# Altium schematic sheet ETHNET.SchDoc
size 203 x 152 mm
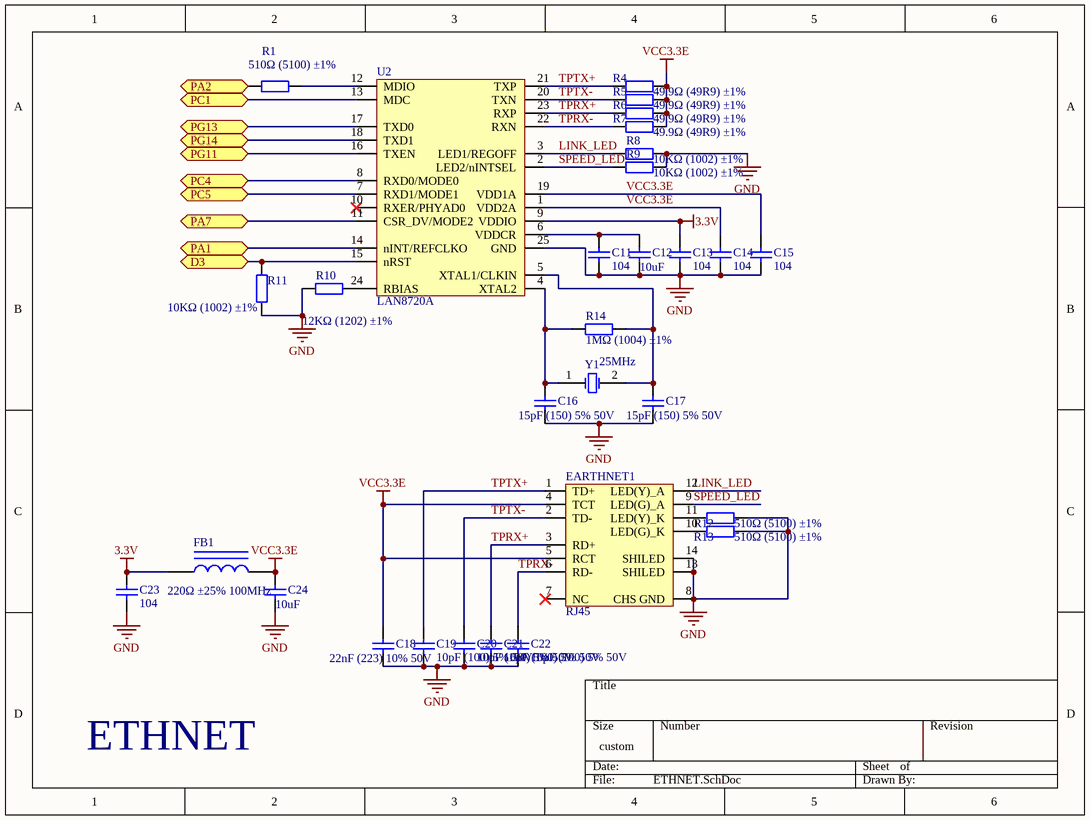
[diagram p0: ETHNET.SchDoc]

## Parts
C11  104  [0805_C]
C12  10uF  [0805_C]
C13  104  [0805_C]
C14  104  [0805_C]
C15  104  [0805_C]
C16  15pF (150) 5% 50V  [0805_C]
C17  15pF (150) 5% 50V  [0805_C]
C18  22nF (223) 10% 50V  [0805_C]
C19  10pF (100) 5% 50V  [0805_C]
C20  10pF (100) 5% 50V  [0805_C]
C21  10pF (100) 5% 50V  [0805_C]
C22  10pF (100) 5% 50V  [0805_C]
C23  104  [0805_C]
C24  10uF  [0805_C]
EARTHNET1  RJ45  [HR911105A]
FB1  220Ω ±25% 100MHz  [0805_L]
R1  510Ω (5100) ±1%  [0805_R]
R4  49.9Ω (49R9) ±1%  [0805_R]
R5  49.9Ω (49R9) ±1%  [0805_R]
R6  49.9Ω (49R9) ±1%  [0805_R]
R7  49.9Ω (49R9) ±1%  [0805_R]
R8  10KΩ (1002) ±1%  [0805_R]
R9  10KΩ (1002) ±1%  [0805_R]
R10  12KΩ (1202) ±1%  [0805_R]
R11  10KΩ (1002) ±1%  [0805_R]
R12  510Ω (5100) ±1%  [0805_R]
R13  510Ω (5100) ±1%  [0805_R]
R14  1MΩ (1004) ±1%  [0805_R]
U2  LAN8720A  [QFN24]
Y1  25MHz  [XTAL_US]

## Ports
D3, PA1, PA2, PA7, PC1, PC4, PC5, PG11, PG13, PG14

## Nets
3.3V: C13.2 C23.2 FB1.1 U2.9(VDDIO)
GND: C11.1 C12.1 C13.1 C14.1 C15.1 C16.1 C17.1 C18.1 C19.1 C20.1 C21.1 C22.1 C23.1 C24.1 EARTHNET1.8(CHS_GND) EARTHNET1.13(SHILED) EARTHNET1.14(SHILED) R8.2 R9.2 R10.1 R11.1 R12.1 R13.1 U2.25(GND)
VCC3.3E: C14.2 C15.2 C18.2 C24.2 EARTHNET1.4(TCT) EARTHNET1.5(RCT) FB1.2 R4.2 R5.2 R6.2 R7.2 U2.1(VDD2A) U2.19(VDD1A)
D3: R11.2 U2.15(nRST) ; port D3
LINK_LED: EARTHNET1.12(LED(Y)_A) R8.1 U2.3(LED1/REGOFF)
PA1: U2.14(nINT/REFCLKO) ; port PA1
PA2: R1.1 ; port PA2
PA7: U2.11(CSR_DV/MODE2) ; port PA7
PC1: U2.13(MDC) ; port PC1
PC4: U2.8(RXD0/MODE0) ; port PC4
PC5: U2.7(RXD1/MODE1) ; port PC5
PG11: U2.16(TXEN) ; port PG11
PG13: U2.17(TXD0) ; port PG13
PG14: U2.18(TXD1) ; port PG14
SPEED_LED: EARTHNET1.9(LED(G)_A) R9.1 U2.2(LED2/nINTSEL)
TPRX+: C21.2 EARTHNET1.3(RD+) R6.1 U2.23(RXP)
TPRX-: C22.2 EARTHNET1.6(RD-) R7.1 U2.22(RXN)
TPTX+: C19.2 EARTHNET1.1(TD+) R4.1 U2.21(TXP)
TPTX-: C20.2 EARTHNET1.2(TD-) R5.1 U2.20(TXN)
NetC11_2: C11.2 C12.2 U2.6(VDDCR)
NetC16_2: C16.2 R14.1 U2.4(XTAL2) Y1.1(OSC1)
NetC17_2: C17.2 R14.2 U2.5(XTAL1/CLKIN) Y1.2(OSC2)
NetEARTHNET1_10: EARTHNET1.10(LED(G)_K) R13.2
NetEARTHNET1_11: EARTHNET1.11(LED(Y)_K) R12.2
NetR1_2: R1.2 U2.12(MDIO)
NetR10_2: R10.2 U2.24(RBIAS)

Not connected (* = marked no-connect by the designer): EARTHNET1 7(NC)*; U2 10(RXER/PHYAD0)*

## Notes on the sheet
- ETHNET

## Library data of the parts
C11-C15 C23 C24 = 0805 100nF(104) 10% 50V: 贴片电容; ComponentLink1Description: 供应商链接; ComponentLink1URL: http://www.szlcsc.com/product/details_50686.html; Package: 0805; Supplier: LC; SuppliersPartNumber: C49678
C16 C17 = 0805 15pF (150) 5% 50V: 贴片电容; ComponentLink1Description: 供应商链接; ComponentLink1URL: http://www.szlcsc.com/product/details_2146.html; Package: 0805; Supplier: LC; SuppliersPartNumber: C1794
C18 = 0805 22nF (223) 10% 50V: 贴片电容; ComponentLink1Description: 供应商链接; ComponentLink1URL: http://www.szlcsc.com/product/details_2081.html; Package: 0805; Supplier: LC; SuppliersPartNumber: C1729
C19-C22 = 0805 10pF (100) 5% 50V: 贴片电容; ComponentLink1Description: 供应商链接; ComponentLink1URL: http://www.szlcsc.com/product/details_2137.html; Package: 0805; Supplier: LC; SuppliersPartNumber: C1785
EARTHNET1 = HR911105
FB1 = 0805 100Ω 25% 100MHz: 贴片磁珠; ComponentLink1Description: 供应商链接; ComponentLink1URL: http://www.szlcsc.com/product/details_1367.html; Package: 0805; Supplier: LC; SuppliersPartNumber: C1015
R1 R12 R13 = 0805 510Ω (5100) 1%: 贴片电阻; ComponentLink1Description: 供应商链接; ComponentLink1URL: http://www.szlcsc.com/product/details_18422.html; Package: 0805; Supplier: LC; SuppliersPartNumber: C17734
R4-R7 = 0805 49.9Ω (49R9) 1%: 贴片电阻; ComponentLink1Description: 供应商链接; ComponentLink1URL: http://www.szlcsc.com/product/details_18408.html; Package: 0805; Supplier: LC; SuppliersPartNumber: C17720
R8 R9 R11 = 0805 10KΩ (1002) 1%: 贴片电阻; ComponentLink1Description: 供应商链接; ComponentLink1URL: http://www.szlcsc.com/product/details_18102.html; Package: 0805; Supplier: LC; SuppliersPartNumber: C17414
R10 = 0805 12KΩ (1202) 1%: 贴片电阻; ComponentLink1Description: 供应商链接; ComponentLink1URL: http://www.szlcsc.com/product/details_18132.html; Package: 0805; Supplier: LC; SuppliersPartNumber: C17444
R14 = 0805 1MΩ (1004) 1%: 贴片电阻; ComponentLink1Description: 供应商链接; ComponentLink1URL: http://www.szlcsc.com/product/details_18202.html; Package: 0805; Supplier: LC; SuppliersPartNumber: C17514
U2 = LAN8720: ETH PHY
Y1 = XTAL: Crystal Oscillator; Published: 8-Jun-2000; LatestRevisionDate: 17-Jul-2002; LatestRevisionNote: Re-released for DXP Platform.; Publisher: Altium Limited